# Altium project TK512_Optisk_Mottaker.PrjPcb
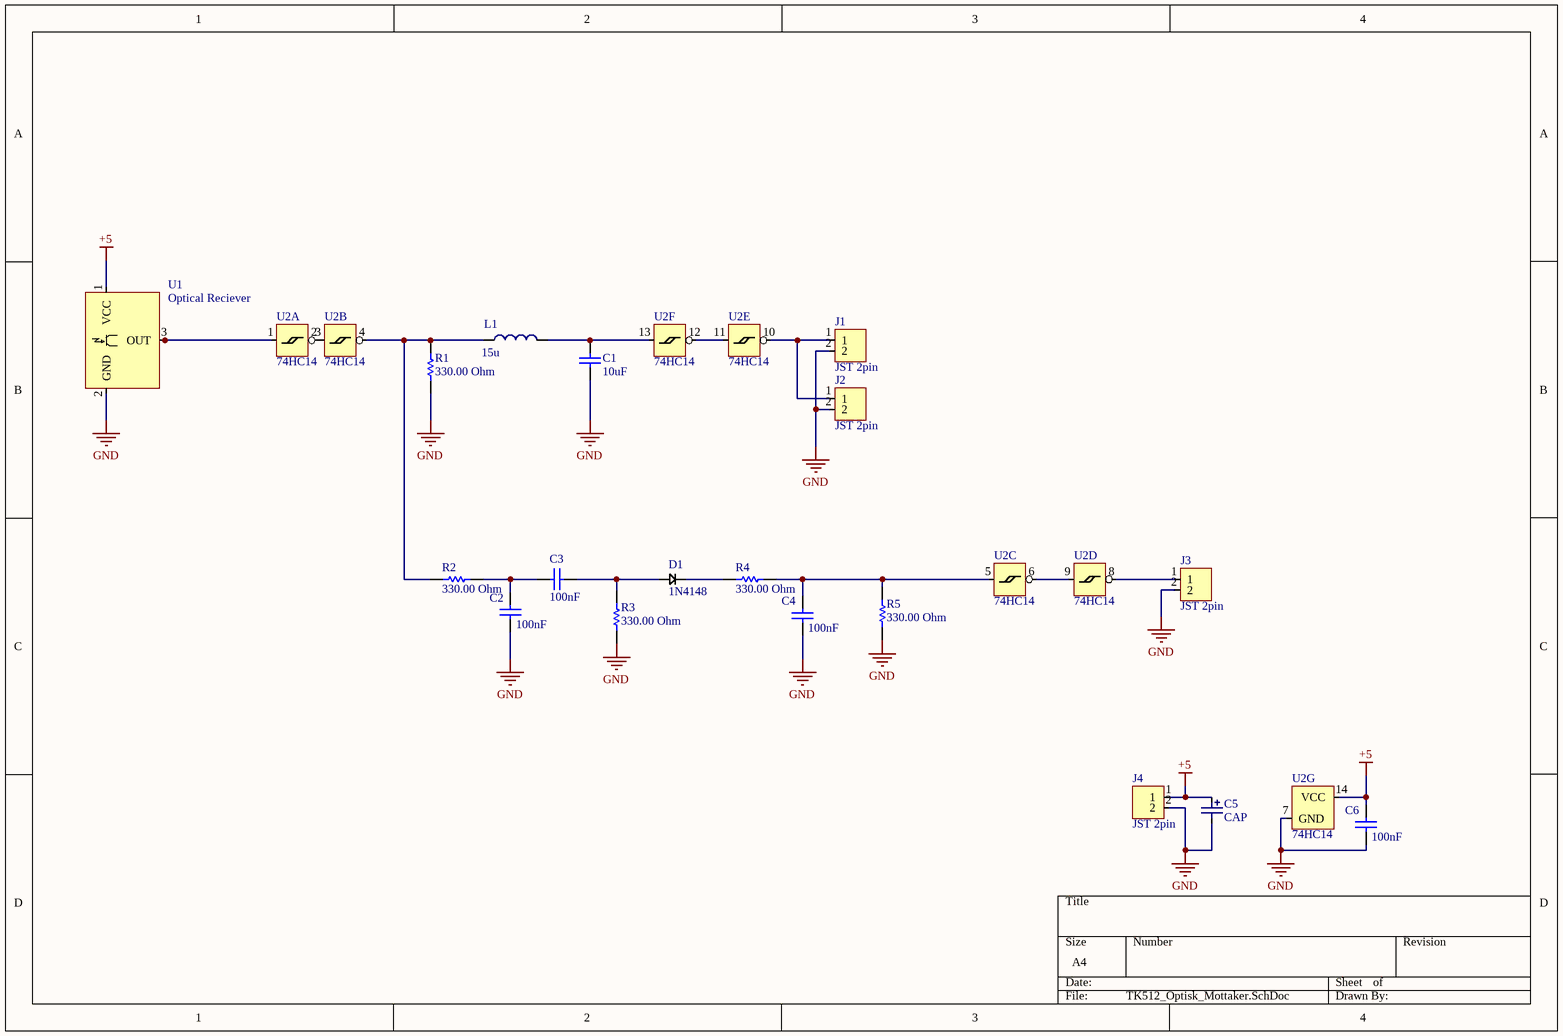
[diagram p0: TK512_Optisk_Mottaker.SchDoc]
1 sheet, 19 parts. Net scope: global (net labels, ports and power ports of the same name join across sheets).
Board file: TK512_Optisk_Mottaker.PcbDoc

## Sheet TK512_Optisk_Mottaker.SchDoc
size A4

### Parts
C1  value 10uF  [CAPC1206(3216)190_L]  (hidden comment: CAP 10uF 25V 1206(3216))
C2  value 100nF  [CAPC0805(2012)145_M]  (hidden comment: CAP 100nF 25V 0805(2012))
C3  value 100nF  [CAPC0805(2012)145_M]  (hidden comment: CAP 100nF 25V 0805(2012))
C4  value 100nF  [CAPC0805(2012)145_M]  (hidden comment: CAP 100nF 25V 0805(2012))
C5  CAP  [CAP 2.5mm]
C6  value 100nF  [CAPC0805(2012)145_M]  (hidden comment: CAP 100nF 25V 0805(2012))
D1  1N4148  [1N4148]
J1  JST 2pin  [JST 2pin]
J2  JST 2pin  [JST 2pin]
J3  JST 2pin  [JST 2pin]
J4  JST 2pin  [JST 2pin]
L1  value 15u  [SMD4mm]  (hidden comment: L)
R1  value 330.00 Ohm  [RESC0805(2012)_L]  (hidden comment: 330R 5% 0805(2012))
R2  value 330.00 Ohm  [RESC0805(2012)_L]  (hidden comment: 330R 5% 0805(2012))
R3  value 330.00 Ohm  [RESC0805(2012)_L]  (hidden comment: 330R 5% 0805(2012))
R4  value 330.00 Ohm  [RESC0805(2012)_L]  (hidden comment: 330R 5% 0805(2012))
R5  value 330.00 Ohm  [RESC0805(2012)_L]  (hidden comment: 330R 5% 0805(2012))
U1  Optical Reciever  [GP1FAV50TK]
U2  74HC14  [SOP14]  (parts A,B,C,D,E,F,G of 7)

### Nets
+5: C5.2 C6.2 J4.1 U1.1(VCC) U2.14(VCC)
GND: C1.1 C2.1 C4.1 C5.1 C6.1 J1.2 J2.2 J3.2 J4.2 R1.2 R3.1 R5.1 U1.2(GND) U2.7(GND)
NetC1_2: C1.2 L1.2 U2.13
NetC2_2: C2.2 C3.2 R2.2
NetC3_1: C3.1 D1.A R3.2
NetC4_2: C4.2 R4.2 R5.2 U2.5
NetD1_K: D1.K R4.1
NetJ1_1: J1.1 J2.1 U2.10
NetJ3_1: J3.1 U2.8
NetL1_1: L1.1 R1.1 R2.1 U2.4
NetU1_3: U1.3(OUT) U2.1
NetU2_2: U2.2 U2.3
NetU2_6: U2.6 U2.9
NetU2_11: U2.11 U2.12

### Library data of the parts
C1 = CMP-1037-04979-1: CAP 10uF 25V ±10% 1206 (3216 Metric) Thickness 1.9mm SMD; Case-EIA: 1206; Case-Metric: 3216; Rated Voltage: 25 V; Technology: SMT; Tolerance: ±10%; Max Thickness: 1.9 mm
C2-C4 C6 = CMP-1036-04408-1: CAP 100nF 25V ±5% 0805 (2012 Metric) Thickness 1.45mm SMD; Case-Metric: 2012; Case-EIA: 0805; Rated Voltage: 25 V; Max Thickness: 1.45 mm; Technology: SMT; Tolerance: ±5%
R1-R5 = CMP-1013-00062-1: 330R 0.125W 5% 0805 (2012 Metric)  SMD; Case-EIA: 0805; Case-Metric: 2012; Tolerance: 5 %; Power: 0.125 W; Technology: SMT
U1 = Otical Reciever